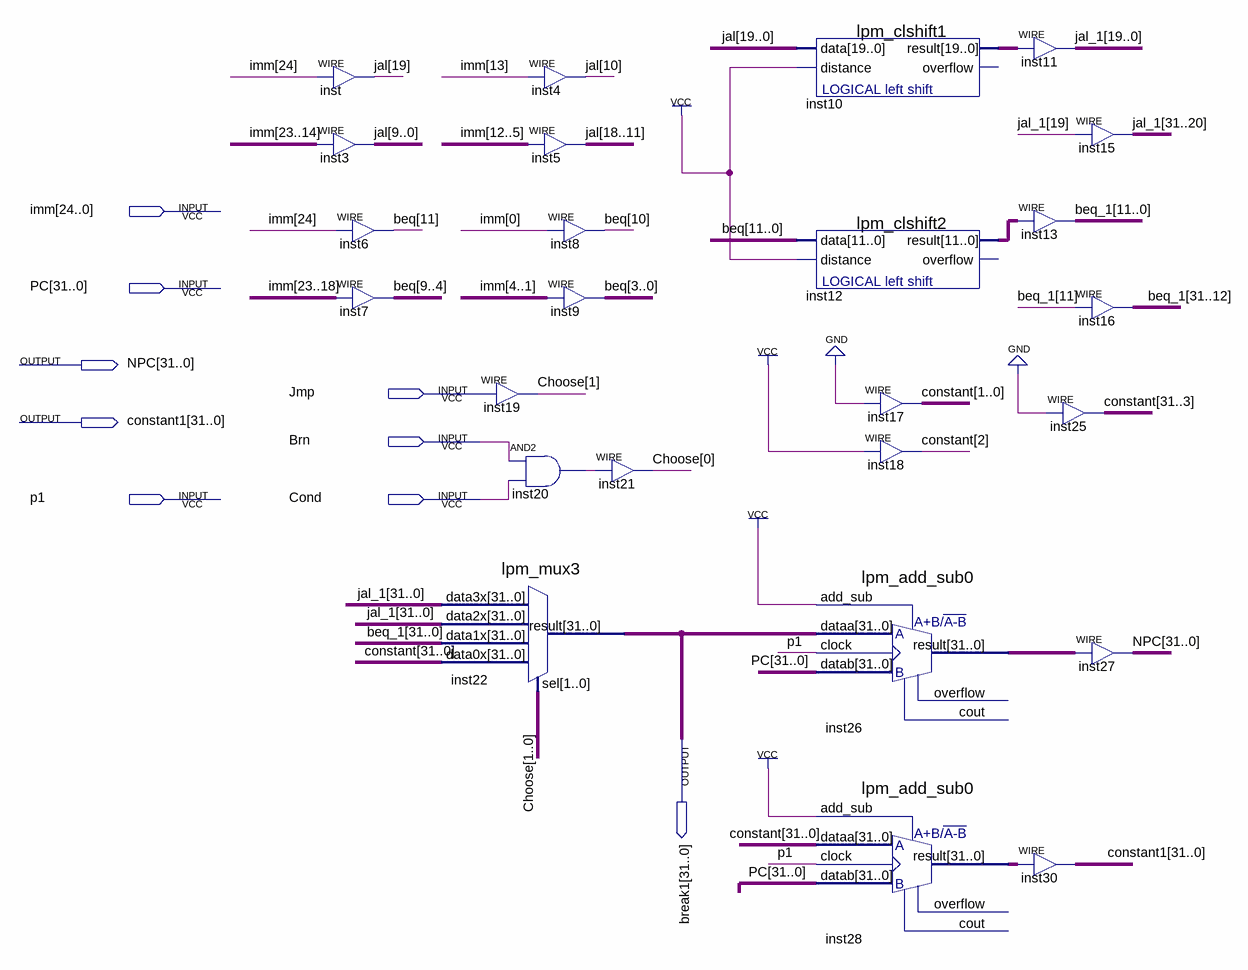
[diagram p0: schematic sheet]
// Quartus schematic ACU.bdf as structural Verilog: 25 symbols, 9 pins
module ACU (
  input  [24:0] imm,
  input  [31:0] PC,
  input  Jmp,
  input  Brn,
  input  p1,
  input  Cond,
  output [31:0] NPC,
  output [31:0] constant1,
  output [31:0] break1
);

  wire inst20_out;
  wire [1:0] Choose;
  wire [11:0] beq, inst12_result;
  wire [19:0] inst10_result, jal;
  wire [31:0] beq_1, constant, inst26_result, inst28_result, jal_1;

  assign jal[19] = imm[24];  // WIRE inst
  assign jal[9:0] = imm[23:14];  // WIRE inst3
  assign beq[11] = imm[24];  // WIRE inst6
  assign beq[9:4] = imm[23:18];  // WIRE inst7
  lpm_mux3 inst22 (.data3x(jal_1), .data2x(jal_1), .data1x(beq_1), .data0x(constant), .sel(Choose), .result(break1));
  assign jal[10] = imm[13];  // WIRE inst4
  assign jal[18:11] = imm[12:5];  // WIRE inst5
  assign Choose[1] = Jmp;  // WIRE inst19
  and inst20 (inst20_out, Brn, Cond);
  assign beq[10] = imm[0];  // WIRE inst8
  assign beq[3:0] = imm[4:1];  // WIRE inst9
  assign Choose[0] = inst20_out;  // WIRE inst21
  lpm_clshift1 inst10 (.data(jal), .distance(1'b1), .result(inst10_result));  // open: overflow
  lpm_clshift2 inst12 (.data(beq), .distance(1'b1), .result(inst12_result));  // open: overflow
  lpm_add_sub0 inst26 (
    .dataa(break1), .datab(PC), .clock(p1), .add_sub(1'b1), .result(inst26_result));  // open: overflow, cout
  lpm_add_sub0 inst28 (
    .dataa(constant), .datab(PC), .clock(p1), .add_sub(1'b1), .result(inst28_result));  // open: overflow, cout
  assign constant[1:0] = 2'b00;  // WIRE inst17
  assign constant[2] = 1'b1;  // WIRE inst18
  assign jal_1[19:0] = inst10_result;  // WIRE inst11
  assign jal_1[31:20] = {12{jal_1[19]}};  // WIRE inst15
  assign beq_1[11:0] = inst12_result;  // WIRE inst13
  assign beq_1[31:12] = {20{beq_1[11]}};  // WIRE inst16
  assign constant[31:3] = {29{1'b0}};  // WIRE inst25
  assign NPC = inst26_result;  // WIRE inst27
  assign constant1 = inst28_result;  // WIRE inst30
endmodule
